# EAGLE design ConstantCurrentSupply_NPN (EAGLE 6.3)
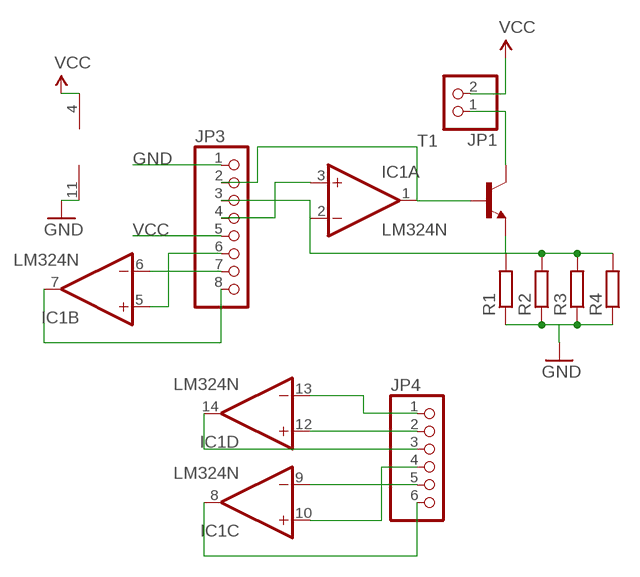
[diagram p0: schematic, sheet 1]

## Parts
IC1  LM324N  [DIL14]
JP1  PINHD-1X2  [1X02]
JP3  PINHD-1X8  [1X08]
JP4  PINHD-1X6  [1X06]
R1  R-EU_0204/2V  [0204V]
R2  R-EU_0204/2V  [0204V]
R3  R-EU_0204/2V  [0204V]
R4  R-EU_0204/2V  [0204V]
T1  2N3904-NPN-TO92-EBC  [TO92-EBC]

## Nets
GND: IC1.11(P:V-) JP3.1 R1.1 R2.1 R3.1 R4.1
N$1: IC1.2(A:-IN) JP3.3 R1.2 R2.2 R3.2 R4.2 T1.E
N$2: IC1.1(A:OUT) JP3.2 T1.B
N$3: JP1.1 T1.C
N$4: IC1.3(A:+IN) JP3.4
N$5: IC1.5(B:+IN) JP3.6
N$6: IC1.6(B:-IN) JP3.7
N$7: IC1.7(B:OUT) JP3.8
N$8: IC1.10(C:+IN) JP4.4
N$9: IC1.13(D:-IN) JP4.1
N$10: IC1.12(D:+IN) JP4.2
N$11: IC1.14(D:OUT) JP4.3
N$12: IC1.9(C:-IN) JP4.5
N$13: IC1.8(C:OUT) JP4.6
VCC: IC1.4(P:V+) JP1.2 JP3.5

## Library data of the parts
IC1 = linear:LM324: OP AMP
JP1 = pinhead:PINHD-1X2: PIN HEADER
JP3 = pinhead:PINHD-1X8: PIN HEADER
JP4 = pinhead:PINHD-1X6: PIN HEADER
R1-R4 = rcl:R-EU_: RESISTOR, European symbol
T1 = transistor-neu-to92:*-NPN-: NPN Transistror

## Board
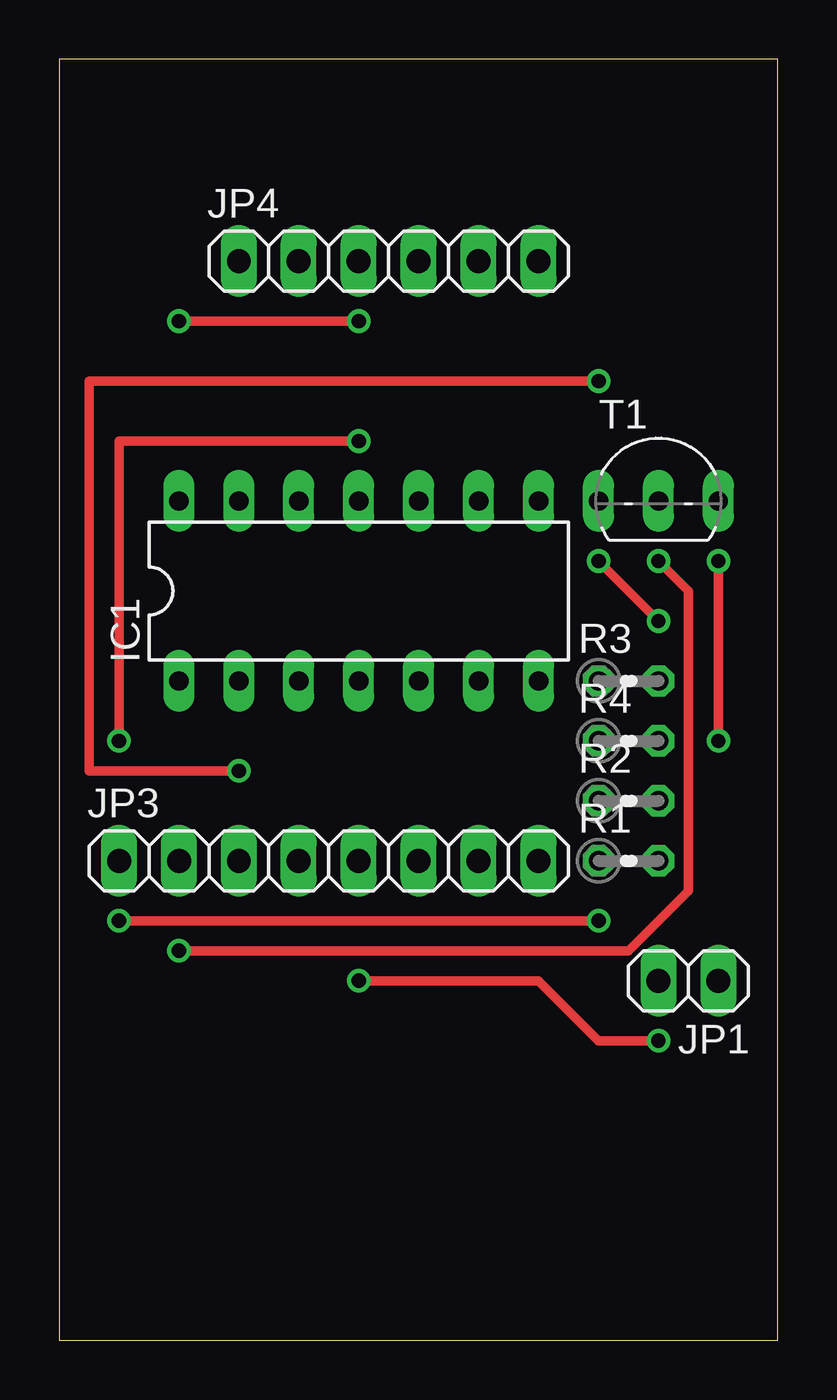
[diagram p1: board, top side]
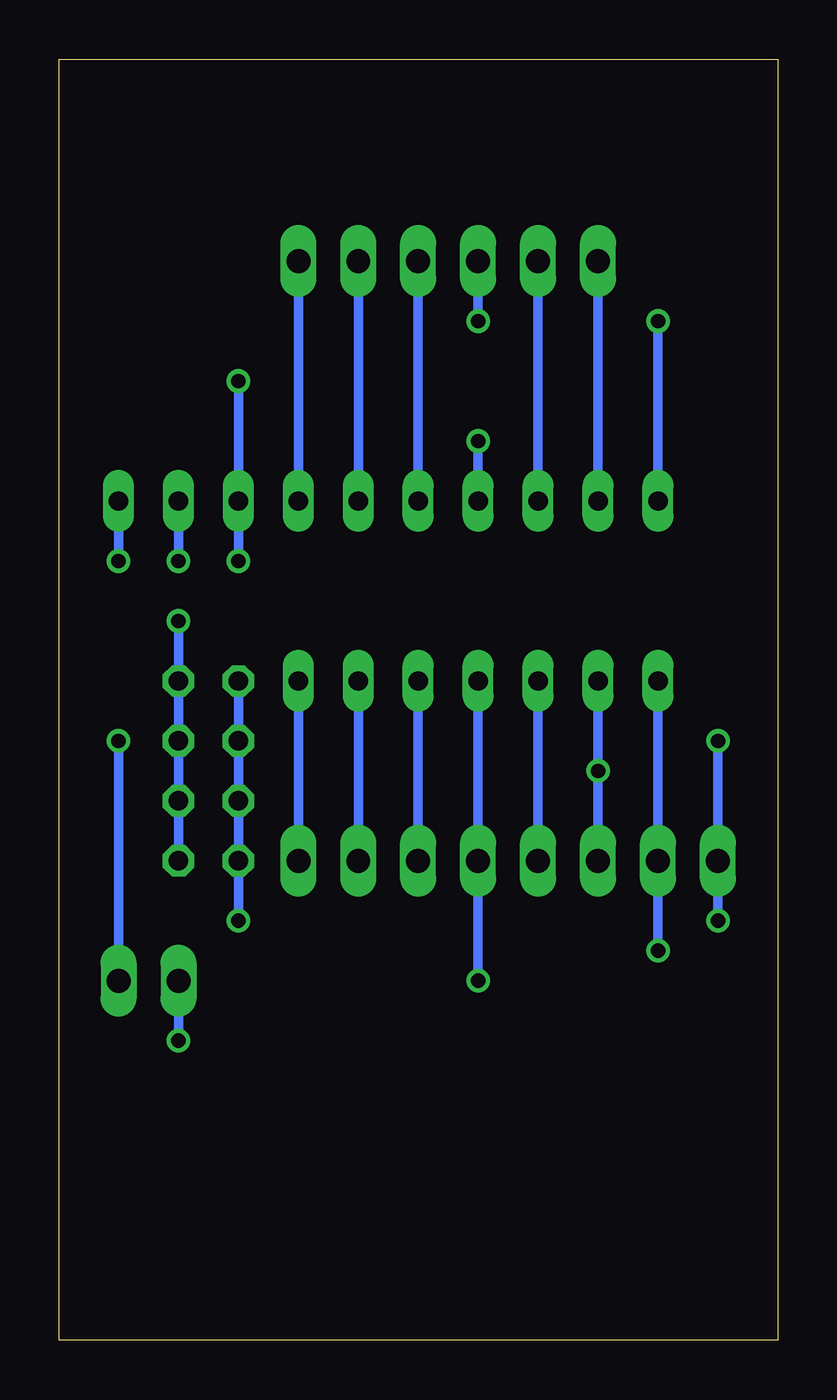
[diagram p2: board, bottom side, seen from below]

Size 30.46 x 54.28 mm. Coordinates in mm from the lower left corner, seen from the top.
Outline: 0,0 30.46,0 30.46,54.28 0,54.28 0,0
Copper layers (1*16): Top 0.035mm / dielectric 1.5mm / Bottom 0.035mm
Design rules "default": minimum track width 10mil, minimum drill 24mil, track to track 8mil, track to pad 8mil, pad to pad 8mil, via to via 8mil, smd to smd 8mil, copper to edge 40mil, drill to drill 8mil, minimum pad ring 10mil, minimum via ring 8mil, stop-mask expansion 4mil, vias tented up to drill 0mil, thermal gap 10mil

### Footprints (pad centres in the part's own frame; a part is rotated, then mirrored left to right if it is on the bottom)
DIL14 = drill 0.813 long: 1 -7.62,-3.81; 2 -5.08,-3.81; 3 -2.54,-3.81; 4 0,-3.81; 5 2.54,-3.81; 6 5.08,-3.81; 7 7.62,-3.81; 8 7.62,3.81; 9 5.08,3.81; 10 2.54,3.81; 11 0,3.81; 12 -2.54,3.81; 13 -5.08,3.81; 14 -7.62,3.81
1X02 = drill 1.016 long: 1 -1.27,0; 2 1.27,0
1X08 = drill 1.016 long: 1 -8.89,0; 2 -6.35,0; 3 -3.81,0; 4 -1.27,0; 5 1.27,0; 6 3.81,0; 7 6.35,0; 8 8.89,0
1X06 = drill 1.016 long: 1 -6.35,0; 2 -3.81,0; 3 -1.27,0; 4 1.27,0; 5 3.81,0; 6 6.35,0
0204V = drill 0.813 octagon: 1 -1.27,0; 2 1.27,0
TO92-EBC = drill 0.813 long: B 0,-1.27; C 2.54,-1.27; E -2.54,-1.27

### Placement (x,y rotation side)
IC1  12.7,31.75 0 top
JP1  26.67,15.24 180 top
JP3  11.43,20.32 0 top
JP4  13.97,45.72 0 top
R1  24.13,20.32 0 top
R2  24.13,22.86 0 top
R3  24.13,27.94 0 top
R4  24.13,25.4 0 top
T1  25.4,36.83 0 top

### Tracks (layer width: path | path; a pad name or v marks a point on that pad's centre or on a via)
GND  (via drill 0.6)
  Top 0.406: v2.54,25.4 2.54,38.1 v12.7,38.1 | v22.86,17.78 v2.54,17.78
  Bottom 0.406: R3.1 R4.1 R2.1 R1.1 v22.86,17.78 | v2.54,25.4 JP3.1 v2.54,17.78 | v12.7,38.1 IC1.11
N$1  (via drill 0.6)
  Top 0.406: v22.86,33.02 v25.4,30.48 | v7.62,24.13 1.27,24.13 1.27,40.64 v22.86,40.64
  Bottom 0.406: R1.2 R2.2 R4.2 R3.2 v25.4,30.48 | v22.86,33.02 T1.E v22.86,40.64 | JP3.3 v7.62,24.13 IC1.2
N$2  (via drill 0.6)
  Top 0.406: v25.4,33.02 26.67,31.75 26.67,19.05 24.13,16.51 v5.08,16.51
  Bottom 0.406: IC1.1 JP3.2 v5.08,16.51 | T1.B v25.4,33.02
N$3  (via drill 0.6)
  Top 0.406: v27.94,33.02 v27.94,25.4
  Bottom 0.406: T1.C v27.94,33.02 | v27.94,25.4 JP1.1
N$4
  Bottom 0.406: IC1.3 JP3.4
N$5
  Bottom 0.406: IC1.5 JP3.6
N$6
  Bottom 0.406: IC1.6 JP3.7
N$7
  Bottom 0.406: IC1.7 JP3.8
N$8
  Bottom 0.406: IC1.10 JP4.4
N$9
  Bottom 0.406: IC1.13 JP4.1
N$10
  Bottom 0.406: IC1.12 JP4.2
N$11  (via drill 0.6)
  Top 0.406: v5.08,43.18 v12.7,43.18
  Bottom 0.406: IC1.14 v5.08,43.18 | v12.7,43.18 JP4.3
N$12
  Bottom 0.406: IC1.9 JP4.5
N$13
  Bottom 0.406: IC1.8 JP4.6
VCC  (via drill 0.6)
  Top 0.406: v25.4,12.7 22.86,12.7 20.32,15.24 v12.7,15.24
  Bottom 0.406: IC1.4 JP3.5 v12.7,15.24 | JP1.2 v25.4,12.7